# EAGLE design LIS2DW12 (EAGLE 7.5.0)
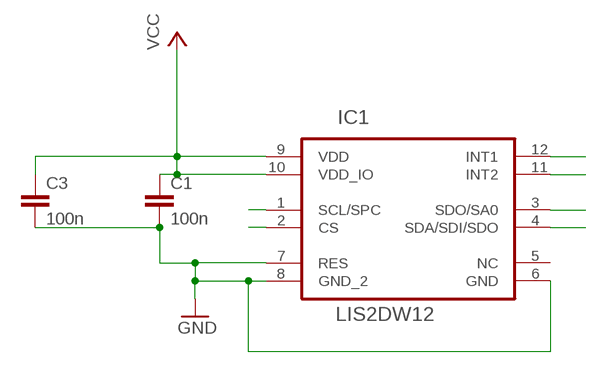
[diagram p0: schematic, sheet 1]

## Parts
C1  100n  C-EUC0402  [C0402]
C3  100n  C-EUC0402  [C0402]
IC1  LIS2DW12  [LGA-12]

## Nets
GND: C1.2 C3.2 IC1.6(GND) IC1.7(RES) IC1.8(GND_2)
N$3: IC1.1(SCL/SPC)
N$4: IC1.2(CS)
N$5: IC1.3(SDO/SA0)
N$6: IC1.4(SDA/SDI/SDO)
N$7: IC1.12(INT1)
N$8: IC1.11(INT2)
VCC: C1.1 C3.1 IC1.9(VDD) IC1.10(VDD_IO)
Unconnected: IC1.5(NC)

## Library data of the parts
C1 C3 = rcl:C-EU: CAPACITOR, European symbol
IC1 = LIS2DW12:LIS2DW12; AVAILABILITY: Unavailable; DESCRIPTION: Accelerometer X, Y, Z Axis ±2g, 4g, 8g, 16g 400Hz 12-LGA (2x2); MF: STMicroelectronics; MP: LIS2DW12; PACKAGE: LGA-12 STMicroelectronics; PRICE: None

## Board
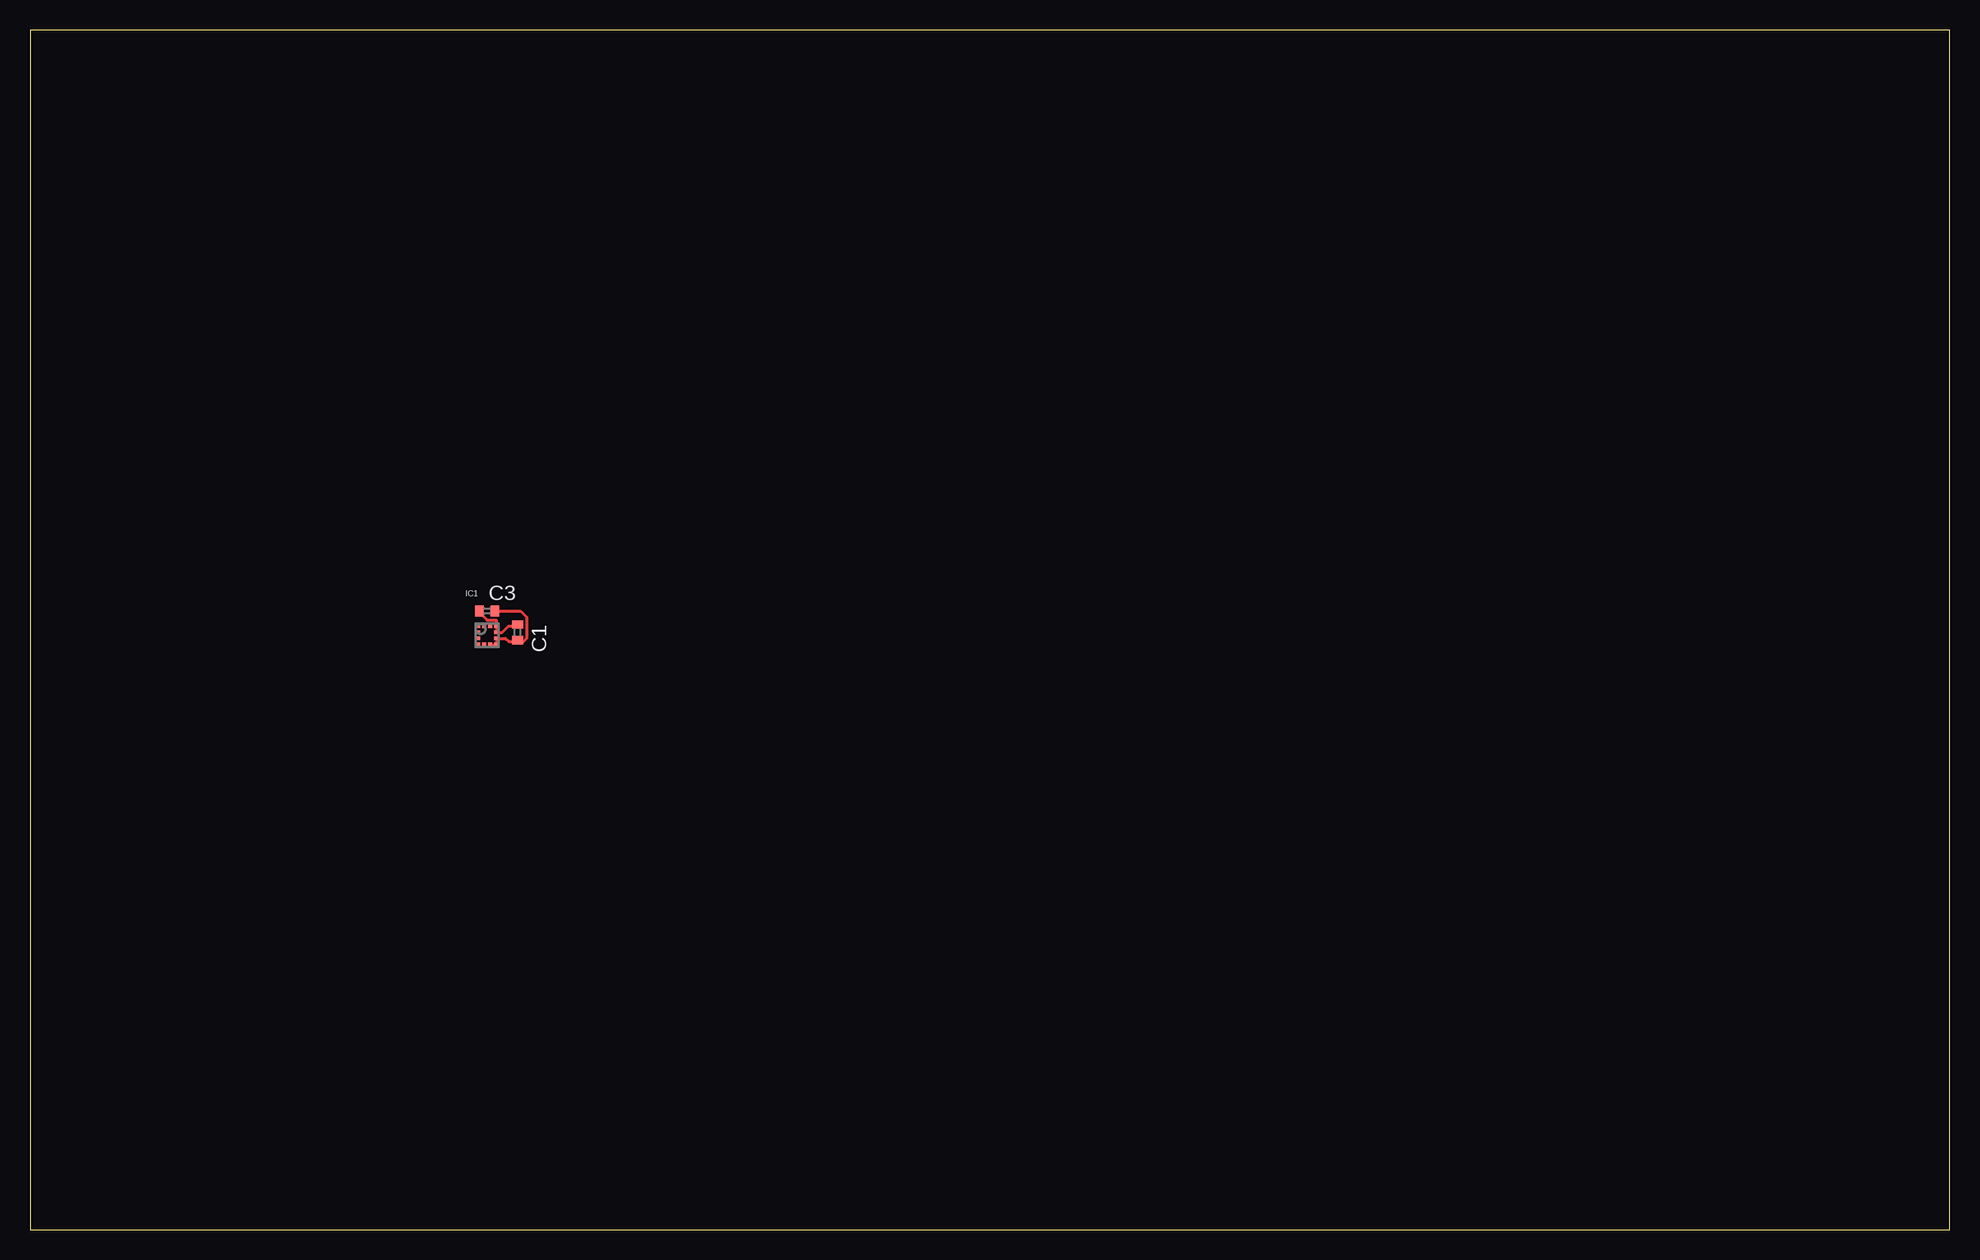
[diagram p1: board, top side]

Size 160 x 100 mm. Coordinates in mm from the lower left corner, seen from the top.
Outline: 0,0 160,0 160,100 0,100 0,0
Copper layers (1*16): Top 0.035mm / dielectric 1.5mm / Bottom 0.035mm
Design rules "default": minimum track width 10mil, minimum drill 24mil, track to track 8mil, track to pad 8mil, pad to pad 8mil, via to via 8mil, smd to smd 8mil, copper to edge 40mil, drill to drill 8mil, minimum pad ring 10mil, minimum via ring 8mil, stop-mask expansion 4mil, vias tented up to drill 0mil, thermal gap 10mil

### Footprints (pad centres in the part's own frame; a part is rotated, then mirrored left to right if it is on the bottom)
C0402 = smd 0.7 x 0.9: 1 -0.65,0; 2 0.65,0
LGA-12 = smd 0.4 x 0.3: 1 -0.8,0.75; 2 -0.8,0.25; 3 -0.8,-0.25; 4 -0.8,-0.75; 7 0.8,-0.75; 8 0.8,-0.25; 9 0.8,0.25; 10 0.8,0.75 | smd 0.3 x 0.4: 5 -0.25,-0.8; 6 0.25,-0.8; 11 0.25,0.8; 12 -0.25,0.8

### Placement (x,y rotation side)
C1  40.64,49.78 270 top
C3  38.1,51.56 0 top
IC1  38.1,49.53 0 top

### Tracks (layer width: path | path; a pad name or v marks a point on that pad's centre or on a via)
GND
  Top 0.254: C3.2 40.89,51.56 41.4,51.05 41.4,49.28 41.15,49.02 40.75,49.02 C1.2 40.53,49.02 39.88,49.02 39.62,49.28 IC1.8 IC1.7 38.85,48.73 IC1.6
VCC
  Top 0.254: C1.1 40.5,50.29 39.88,50.29 39.37,49.78 IC1.9 IC1.10 38.86,50.32 38.86,50.8 38.1,50.8 37.45,51.45 C3.1